# EAGLE design Módulo U.V.C. v.1.0 (EAGLE 9.6.2)
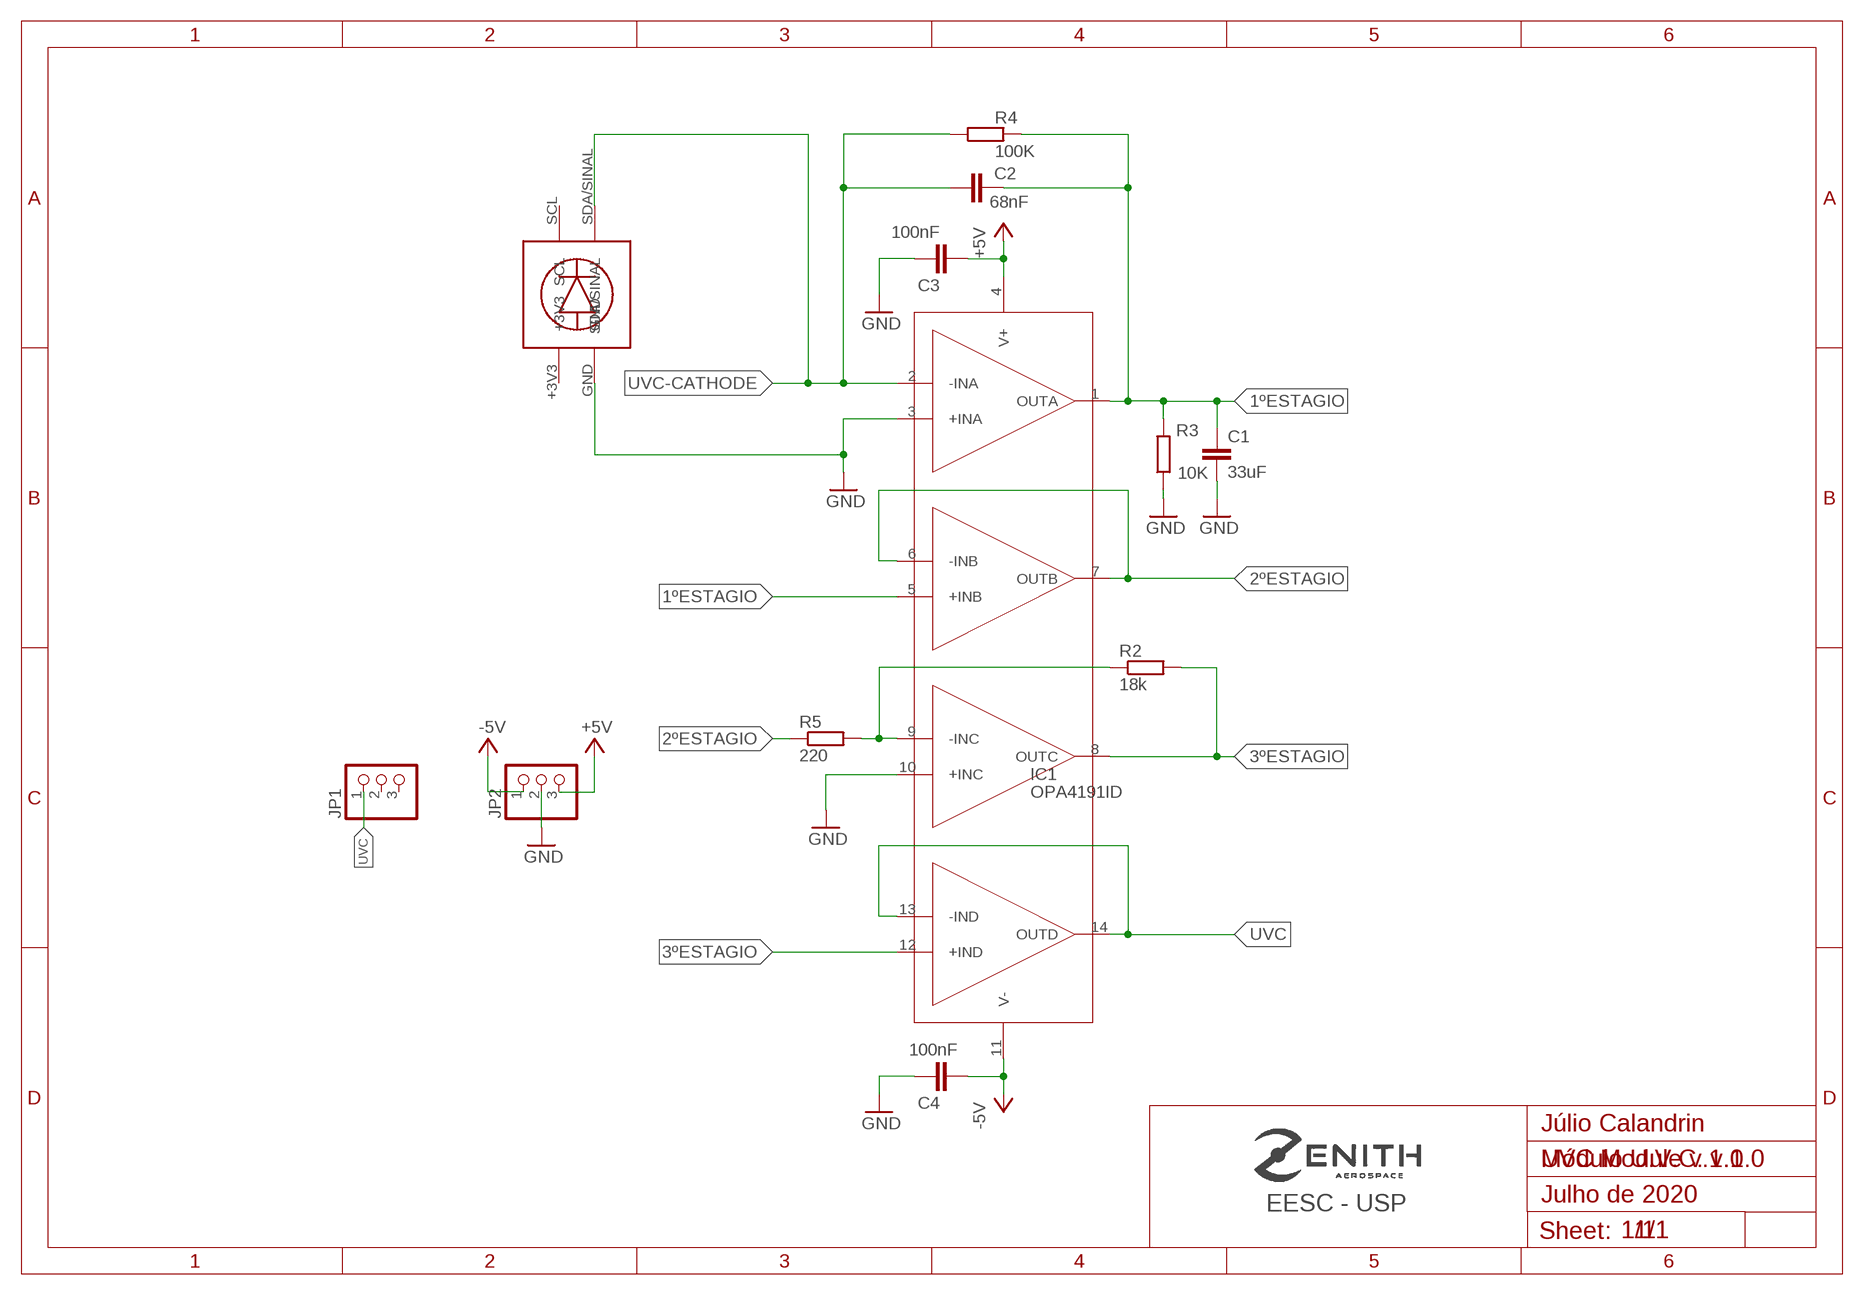
[diagram p0: schematic, sheet 1]

## Parts
C1  33uF  C-EUC0805  [C0805]
C2  68nF  C-EUC0805  [C0805]
C3  100nF  C-EUC0805  [C0805]
C4  100nF  C-EUC0805  [C0805]
IC1  OPA4191ID  [D14_TEX]
JP1  PINHD-1X3  [1X03]
JP2  PINHD-1X3  [1X03]
R2  18k  R-EU_R0805  [R0805]
R3  10K  R-EU_R0805  [R0805]
R4  100K  R-EU_R0805  [R0805]
R5  220  R-EU_R0805  [R0805]
U$3  UNIVERSAL_BREAKOUT  [UNIVERSAL_PADS]

## Nets
1ºESTAGIO: C1.1 C2.2 IC1.1(OUTA) IC1.5(+INB) R3.2 R4.2
2ºESTAGIO: IC1.6(-INB) IC1.7(OUTB) R5.1
3ºESTAGIO: IC1.8(OUTC) IC1.12(+IND) R2.2
+5V: C3.1 IC1.4(V+) JP2.3
-5V: C4.1 IC1.11(V-) JP2.1
GND: C1.2 C3.2 C4.2 IC1.3(+INA) IC1.10(+INC) JP2.2 R3.1 U$3.GND
N$1: IC1.9(-INC) R2.1 R5.2
UVC: IC1.13(-IND) IC1.14(OUTD) JP1.1
UVC-CATHODE: C2.1 IC1.2(-INA) R4.1 U$3.SDA/SINAL
Unconnected: JP1.2 JP1.3 U$3.+3V3 U$3.SCL

## Notes on the sheet
- Júlio Calandrin
- UVC Module v.1.0
- EESC - USP | Julho de 2020
- 1/1

## Library data of the parts
C1-C4 = rcl:C-EU: CAPACITOR, European symbol; SPICEPREFIX: C
IC1 = OPA4191:OPA4191ID; BUILT_BY: EMA_Molly; COPYRIGHT: Copyright (C) 2018 Accelerated Designs. All rights reserved; MANUFACTURER_PART_NUMBER: OPA4191ID; SOURCELIBRARY: TI_2019-05-11; VENDOR: Texas Instruments
JP1 JP2 = pinhead(1x3):PINHD-1X3: PIN HEADER
R2-R5 = rcl:R-EU_: RESISTOR, European symbol; SPICEPREFIX: R
U$3 = Zenith_Breakouts:UNIVERSAL_BREAKOUT

## Board
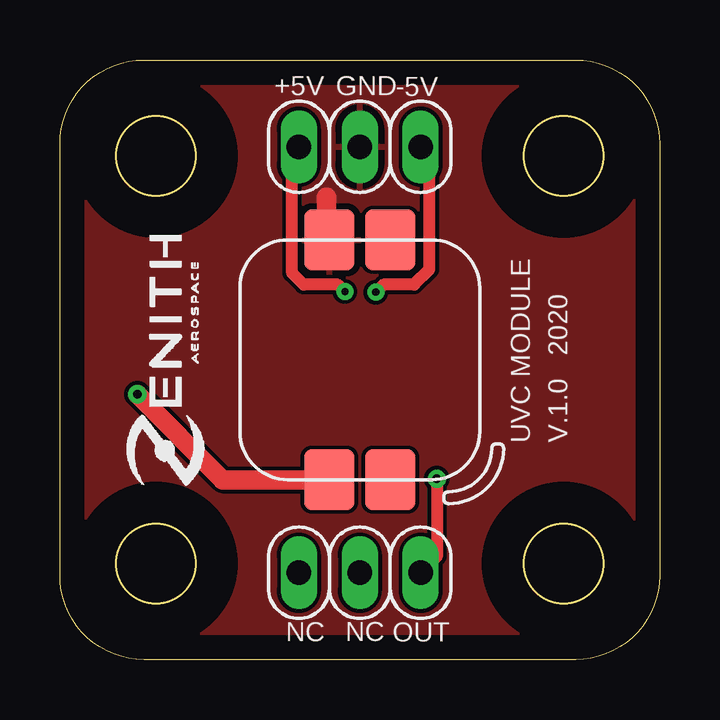
[diagram p1: board, top side]
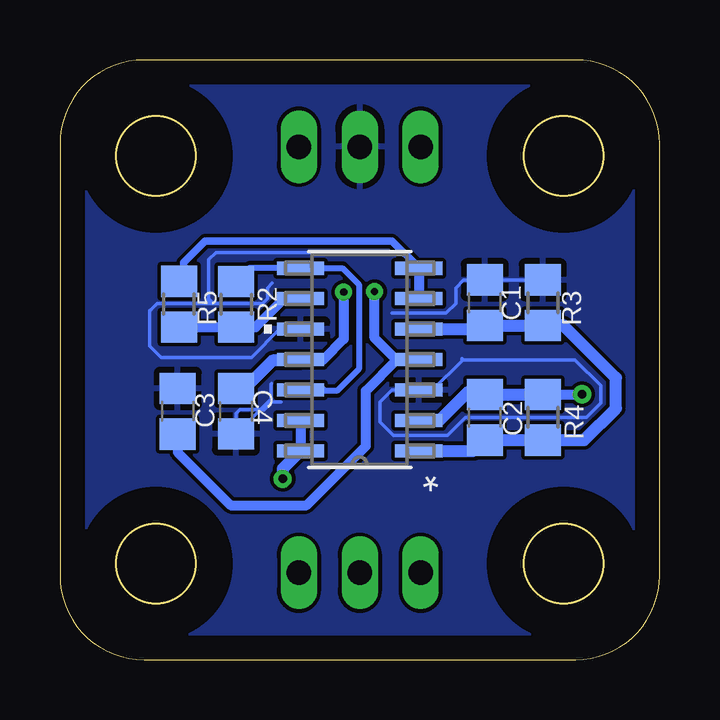
[diagram p2: board, bottom side, seen from below]

Size 25 x 25 mm. Coordinates in mm from the lower left corner, seen from the top.
Outline: 0,3.5 0,21.5 arc-90 3.5,25 21.5,25 arc-90 25,21.5 25,3.5 arc-90 21.5,0 3.5,0 arc-90 0,3.5
Outline: circle at 4,21 radius 1.65
Outline: circle at 21,21 radius 1.65
Outline: circle at 4,4 radius 1.65
Outline: circle at 21,4 radius 1.65
Copper layers (1*16): Top 0.035mm / dielectric 1.5mm / Bottom 0.035mm
Design rules "default": minimum track width 6mil, minimum drill 0.35mm, track to track 6mil, track to pad 6mil, pad to pad 6mil, via to via 6mil, smd to smd 6mil, copper to edge 40mil, drill to drill 6mil, minimum pad ring 10mil, minimum via ring 8mil, stop-mask expansion 4mil, vias tented up to drill 0mil, thermal gap 10mil
tRestrict: area 0.8,17.8 to 7.2,24.2; area 17.8,17.8 to 24.2,24.2; area 0.8,0.8 to 7.2,7.2; area 17.8,0.8 to 24.2,7.2
bRestrict: area 1,18 to 7,24; area 18,18 to 24,24; area 18,1 to 24,7; area 1,1 to 7,7

### Footprints (pad centres in the part's own frame; a part is rotated, then mirrored left to right if it is on the bottom)
C0805 = smd 1.3 x 1.5: 1 -0.95,0; 2 0.95,0
D14_TEX = smd 1.97 x 0.558: 1 -2.464,3.81; 2 -2.464,2.54; 3 -2.464,1.27; 4 -2.464,0; 5 -2.464,-1.27; 6 -2.464,-2.54; 7 -2.464,-3.81; 8 2.464,-3.81; 9 2.464,-2.54; 10 2.464,-1.27; 11 2.464,0; 12 2.464,1.27; 13 2.464,2.54; 14 2.464,3.81
1X03 = drill 1.016 long: 1 -2.54,0; 2 0,0; 3 2.54,0
R0805 = smd 1.3 x 1.5: 1 -0.95,0; 2 0.95,0
UNIVERSAL_PADS = smd 2.54 x 2.1: +3V3 -5,1.27; GND -5,-1.27; SCL 5,1.27; SDA/SINAL 5,-1.27

### Placement (x,y rotation side)
C1  7.29,14.88 90 bottom
C2  7.29,10.1 270 bottom
C3  20.09,10.35 90 bottom
C4  17.66,10.36 270 bottom
IC1  12.51,12.51 180 bottom
JP1  12.5,3.62 180 top
JP2  12.5,21.38 180 top
R2  17.65,14.81 90 bottom
R3  4.87,14.88 270 bottom
R4  4.87,10.1 270 bottom
R5  20.04,14.82 270 bottom
U$3  12.5,12.5 270 top

### Tracks (layer width: path | path; a pad name or v marks a point on that pad's centre or on a via)
1ºESTAGIO
  Bottom 0.254: 7.21,13.46 C1.1 | C2.2 7.54,8.85 | IC1.5 10.01,13.75
  Bottom 0.508: IC1.1 7.74,8.7 C2.2 R4.2 3.15,9.15 1.82,10.48 1.82,11.75 4,13.93 R3.2 C1.1 7.44,13.78 IC1.5
2ºESTAGIO
  Bottom 0.305: R5.1 19.85,15.96 19.85,16.55 18.95,17.45 11.15,17.45 10.04,16.34
  Bottom 0.406: IC1.6 IC1.7 10.04,16.34
3ºESTAGIO
  Bottom 0.254: R2.2 17.07,16.33 14.98,16.33 | IC1.8 13.22,16.32 12.54,15.64 12.54,12.11 13.45,11.2 14.07,11.2 14.11,11.24
  Bottom 0.406: 14.98,16.33 IC1.8 | 14.11,11.24 IC1.12
+5V  (via drill 0.3)
  Top 0.508: v11.88,15.34 11.59,15.63 10.16,15.63 9.68,16.11 9.68,21.1 JP2.3
  Bottom 0.406: C3.1 20.09,8.64 17.88,6.43 14.72,6.43 12.25,8.9 12.25,11.2 10.94,12.51 IC1.4 10.99,12.51 11.88,13.4 v11.88,15.34
-5V  (via drill 0.3)
  Top 0.508: JP2.1 15.4,21.02 15.4,16.27 14.76,15.63 13.49,15.63 v13.17,15.32
  Bottom 0.254: 15.55,12.51 IC1.11
  Bottom 0.406: C4.1 17.5,11.3 | v13.17,15.32 13.17,13.36 14.02,12.51 IC1.11
  Bottom 0.508: C4.1 17.3,11.3 16.14,12.46 15.02,12.46 IC1.11
GND
  Top 0.813: U$3.GND 11.11,17.62 11.11,19.29
  Bottom 0.152: 9.11,11.24 9.4,11.24 9.37,11.27 | C1.2 7.39,15.73 | 4.86,15.83 R3.1 C1.2 | 21.26,14.55 21.26,13.07 20.79,12.6 17.02,12.6 15.84,13.78 IC1.10 14.21,13.78 | 21.21,14.6 20.96,14.85 19,14.85 | 19,14.85 18.8,14.85 | 18.8,14.85 18.6,14.85 | 18.6,14.85 16.55,14.85 16.35,15.05 16.35,15.5 16.15,15.7 | 11.15,14.45 8.9,14.45 8.5,14.85 8.5,15.5 8.17,15.83 C1.2 | 8.25,12.55 8.25,12.5 | 12.42,16.97 18.5,16.97 18.8,16.67 18.8,15.05 | 18.8,15.05 18.8,14.85 | 19,14.85 18.8,15.05 | 18.8,15.05 18.6,14.85 | 15.78,10.73 16.17,10.73 16.5,10.4 16.53,10.43 17.5,10.43 17.66,10.27 C4.2 16.2,10.86 16.2,11.5 16.18,11.52 | 11.16,11.24 IC1.3 9.46,11.24 8.2,12.5 3.53,12.5 2.45,11.42 2.45,10.7 3.05,10.1 8.1,10.1 8.85,9.35 11.1,9.35 11.65,9.9 11.65,10.75 11.16,11.24
  pour Top: -0.5,25.5 25.5,25.5 25.5,-0.5 -0.5,-0.5
  pour Bottom: -1.45,25.5 25.5,25.5 25.5,-0.18 -1.45,-0.18
N$1
  Bottom 0.254: 15.79,15.05 15.65,15.05
  Bottom 0.406: IC1.9 15.65,15.05 16.84,13.86 R2.1 R5.2
UVC  (via drill 0.35)
  Top 0.508: 15.4,3.98 JP1.1 15.72,4.3 v15.72,7.54
  Bottom 0.406: IC1.13 IC1.14
  Bottom 0.508: IC1.14 15.72,7.95 v15.72,7.54
UVC-CATHODE  (via drill 0.35)
  Top 0.813: v3.23,11.06 6.79,7.5 U$3.SDA/SINAL
  Bottom 0.254: 7.1,11.4 7.22,11.12 C2.1 | R4.1 4.89,11.55
  Bottom 0.406: R4.1 v3.24,11.05 v3.23,11.06
  Bottom 0.508: IC1.2 9.18,9.97 8,11.15 7.39,11.15 C2.1 R4.1

### Text on the board
tNames: +5V | GND | -5V | UVC MODULE | V.1.0 2020 | NC | NC | OUT